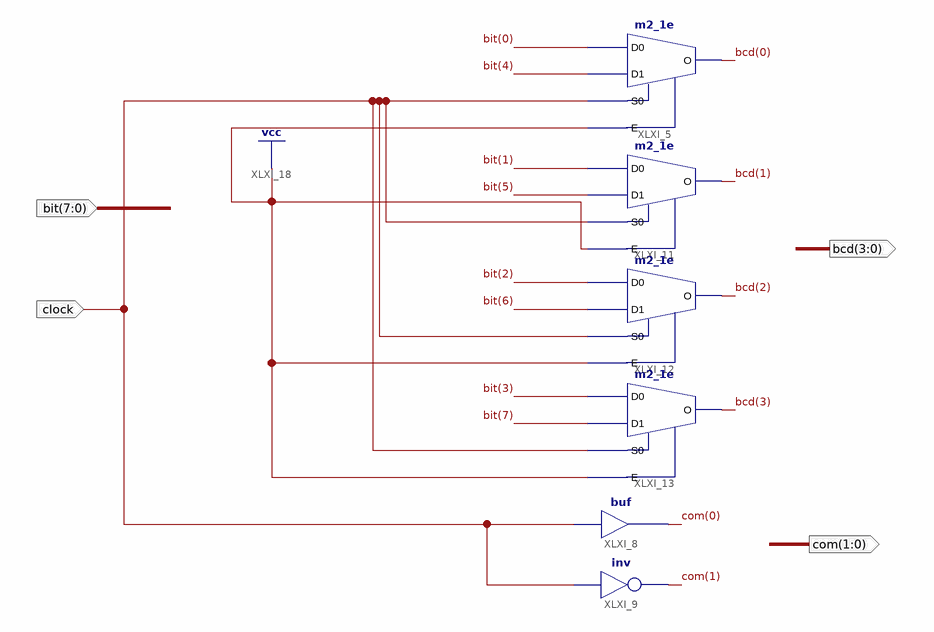
[diagram p0: schematic sheet 1]
// Xilinx ISE schematic myMultiplexer.sch (spartan6) as structural Verilog: 6 symbols, 4 ports
module myMultiplexer (
  input  [7:0] \bit ,
  input  clock,
  output [1:0] com,
  output [3:0] bcd
);

  m2_1e XLXI_5 (.D0(\bit [0]), .D1(\bit [4]), .E(1'b1), .S0(clock), .O(bcd[0]));
  buf XLXI_8 (com[0], clock);
  not XLXI_9 (com[1], clock);
  m2_1e XLXI_11 (.D0(\bit [1]), .D1(\bit [5]), .E(1'b1), .S0(clock), .O(bcd[1]));
  m2_1e XLXI_12 (.D0(\bit [2]), .D1(\bit [6]), .E(1'b1), .S0(clock), .O(bcd[2]));
  m2_1e XLXI_13 (.D0(\bit [3]), .D1(\bit [7]), .E(1'b1), .S0(clock), .O(bcd[3]));
endmodule
